# EAGLE design DC_400VCONVERTER2 (EAGLE 5.11)
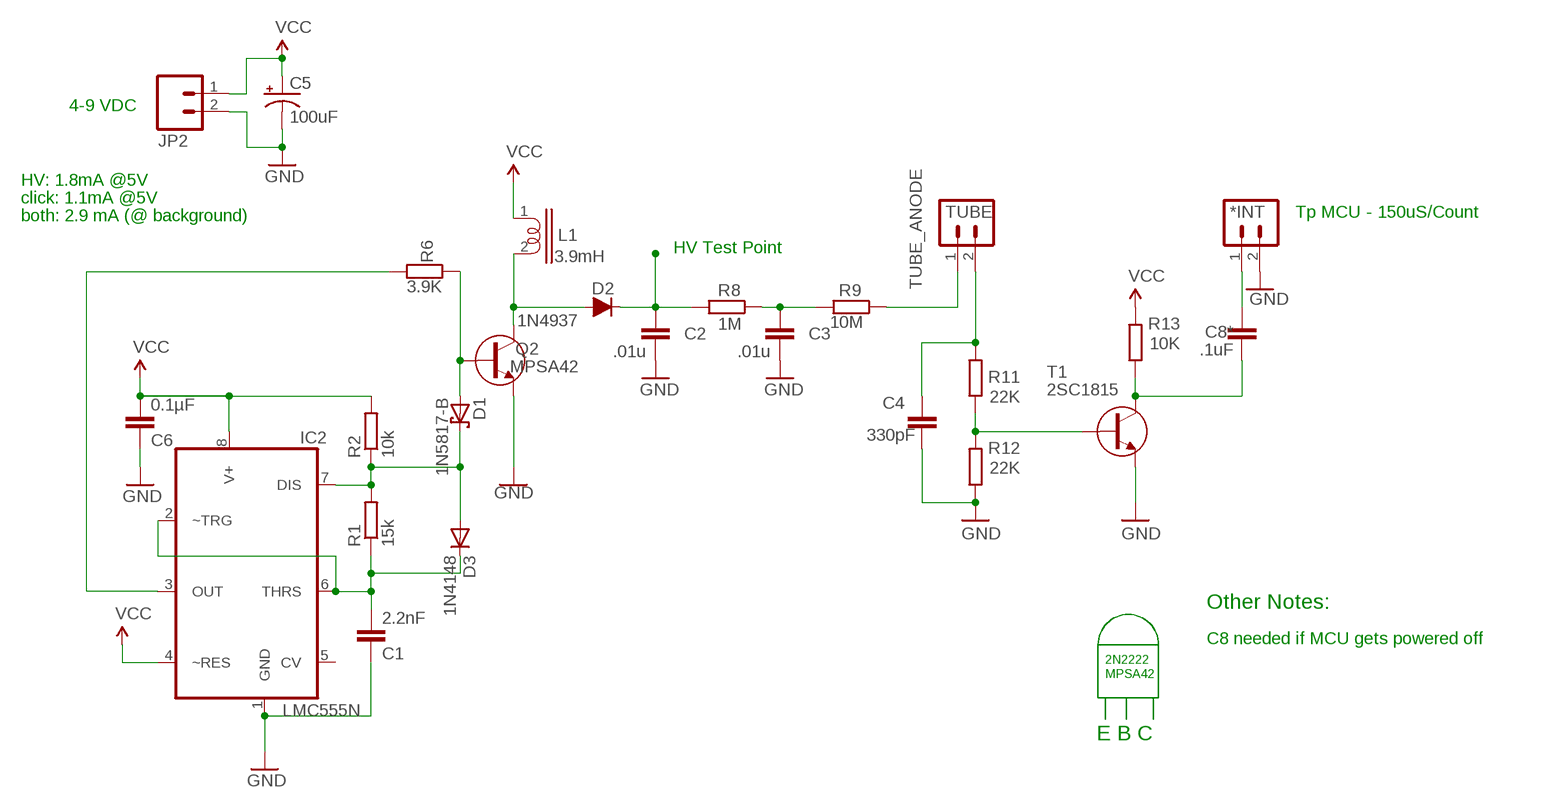
[diagram p0: schematic, sheet 1]

## Parts
*INT  M02PTH  [1X02]
C1  2.2nF  CAPPTH  [CAP-PTH-SMALL]
C2  .01u  C-EU050-025X075  [C050-025X075]
C3  .01u  C-EU050-025X075  [C050-025X075]
C4  330pF  CAPPTH  [CAP-PTH-SMALL]
C5  100uF  CAP_POLPTH1  [CPOL-RADIAL-100UF-25V]
C6  0.1µF  CAPPTH  [CAP-PTH-SMALL]
C8*  .1uF  CAPPTH  [CAP-PTH-SMALL]
D1  1N5817-B  [DO41-7.6]
D2  1N4937  [DO41-7]
D3  1N4148  [DO34-5]
IC2  LMC555N  [DIL08]
JP2  M02SCREW  [SCREWTERMINAL-3.5MM-2]
L1  3.9mH  POW_INDUCTOR_SHORT  [POW_INDUCTOR_TYPE08D]
Q2  MPSA42  [TO92-EBC]
R1  15k  R-EU_0204/5  [0204/5]
R2  10k  R-EU_0204/5  [0204/5]
R6  3.9K  R-EU_0204/5  [0204/5]
R8  1M  R-EU_0204/5  [0204/5]
R9  10M  R-EU_0204/5  [0204/5]
R11  22K  R-EU_0204/5  [0204/5]
R12  22K  R-EU_0204/5  [0204/5]
R13  10K  R-EU_0204/5  [0204/5]
T1  2SC1815  [TO92-ECB]
TUBE  M02PTH  [1X02]

## Nets
GND: *INT.2 C1.1 C2.2 C3.2 C4.1 C5.2(-) C6.1 IC2.1(GND) JP2.2 Q2.E R12.1 T1.1(E)
N$1: C1.2 D3.C IC2.2(~TRG) IC2.6(THRS) R1.1
N$2: C2.1 D2.C R8.2
N$5: C4.2 R11.2 TUBE.2
N$6: C3.1 R8.1 R9.2
N$8: R11.1 R12.2 T1.3(B)
N$9: IC2.3(OUT) R6.2
N$10: D1.A Q2.B R6.1
N$11: D1.C D3.A IC2.7(DIS) R1.2 R2.1
N$14: C8*.2 R13.1 T1.2(C)
N$16: *INT.1 C8*.1
N$17: D2.A L1.2 Q2.C
TUBE_ANODE: R9.1 TUBE.1
VCC: C5.1(+) C6.2 IC2.4(~RES) IC2.8(V+) JP2.1 L1.1 R2.2 R13.2
Unconnected: IC2.5(CV)

## Notes on the sheet
- 4-9 VDC
- HV: 1.8mA @5V
- click: 1.1mA @5V
- both: 2.9 mA (@ background) | Tp MCU - 150uS/Count
- HV Test Point
- Other Notes:
- C8 needed if MCU gets powered off
- 2N2222
- MPSA42
- E B C

## Library data of the parts
*INT JP2 TUBE = _JJG-parts:M02: Header 2 Standard 2-pin 0.1" header. Use with straight break away headers (SKU : PRT-00116), right angle break away headers (PRT-00553), swiss pins (PRT-00743), machine pins (PRT-00117), and female headers (PRT-00115). Molex polarized connector foot print use with SKU : PRT-08233 with associated crimp pins and housings.
C1 C4 C6 C8* = SparkFun:CAP: Capacitor Standard 0603 ceramic capacitor, and 0.1" leaded capacitor.
C2 C3 = resistor:C-EU: CAPACITOR, European symbol
C5 = SparkFun:CAP_POL: Capacitor Polarized These are standard SMD and PTH capacitors. Normally 10uF, 47uF, and 100uF in electrolytic and tantalum varieties. Always verify the external diameter of the through hole cap, it varies with capacity, voltage, and manufacturer. The EIA devices should be standard.
D1 = diode:1N581*: 1.0A SCHOTTKY BARRIER RECTIFIER Source: http://www.diodes.com/datasheets/ds23001.pdf
D2 = JPN:1N493*
D3 = My Library:1N4148
IC2 = My Library:LMC555: CMOS TIMER
L1 = JPN:POW_INDUCTOR_SHORT
Q2 = My Library:MPSA42
R1 R2 R6 R8 R9 R11-R13 = rcl:R-EU_: RESISTOR, European symbol
T1 = My Library:2SC*: NPN TRANSISTOR Big oval pads

## Board
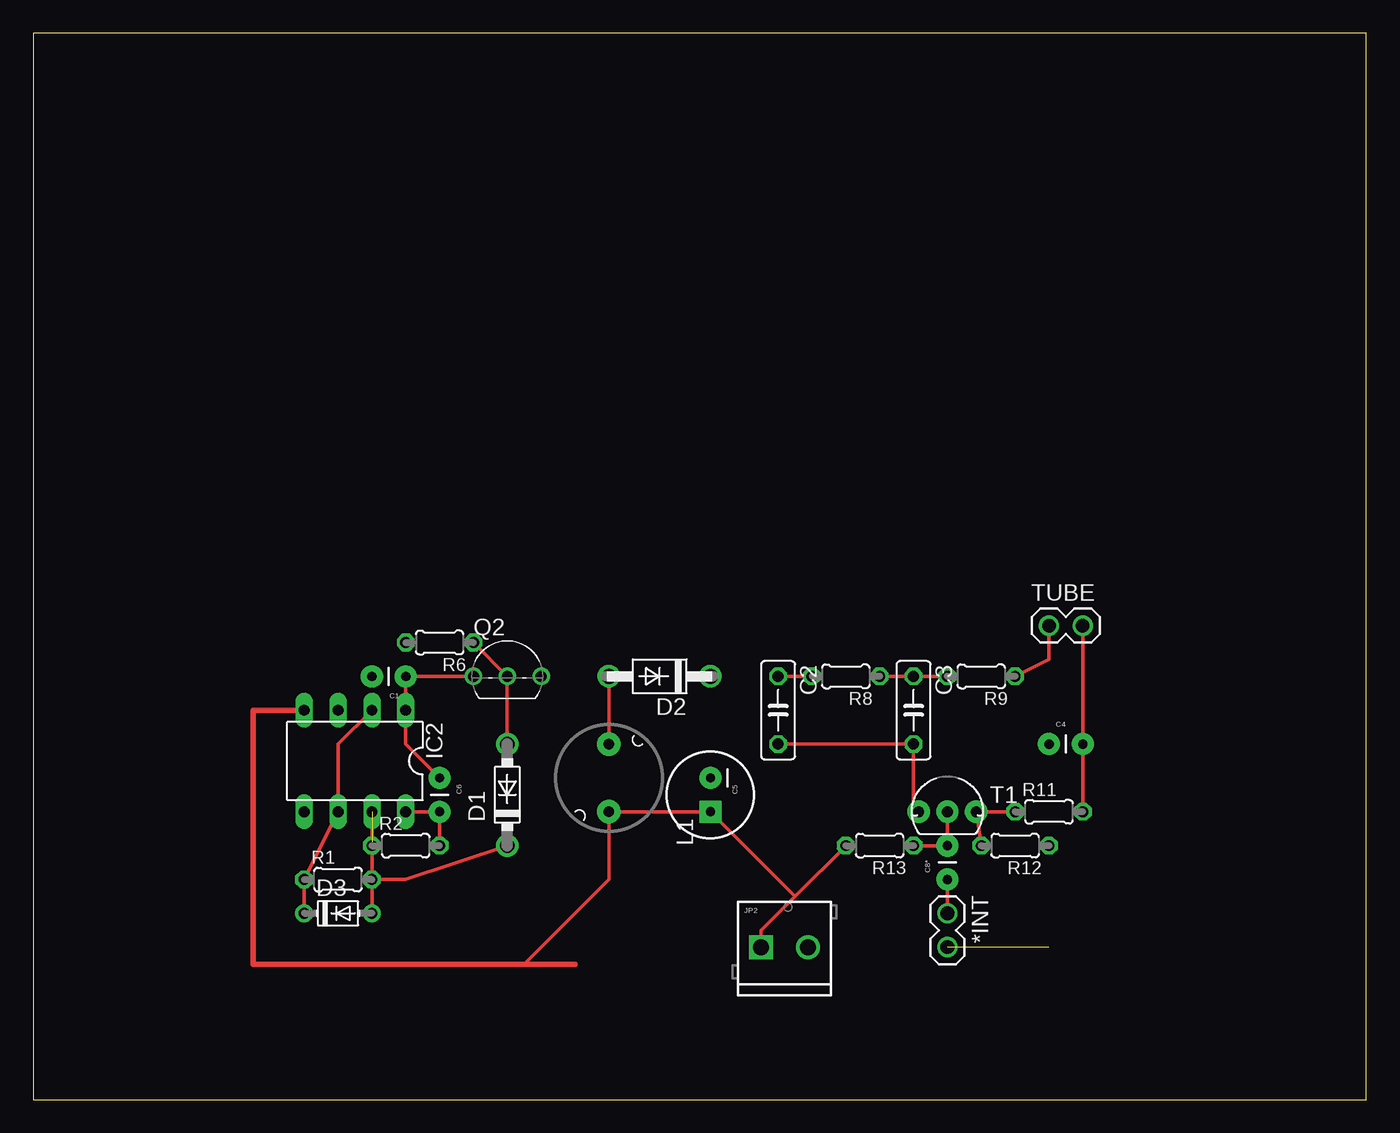
[diagram p1: board, top side]
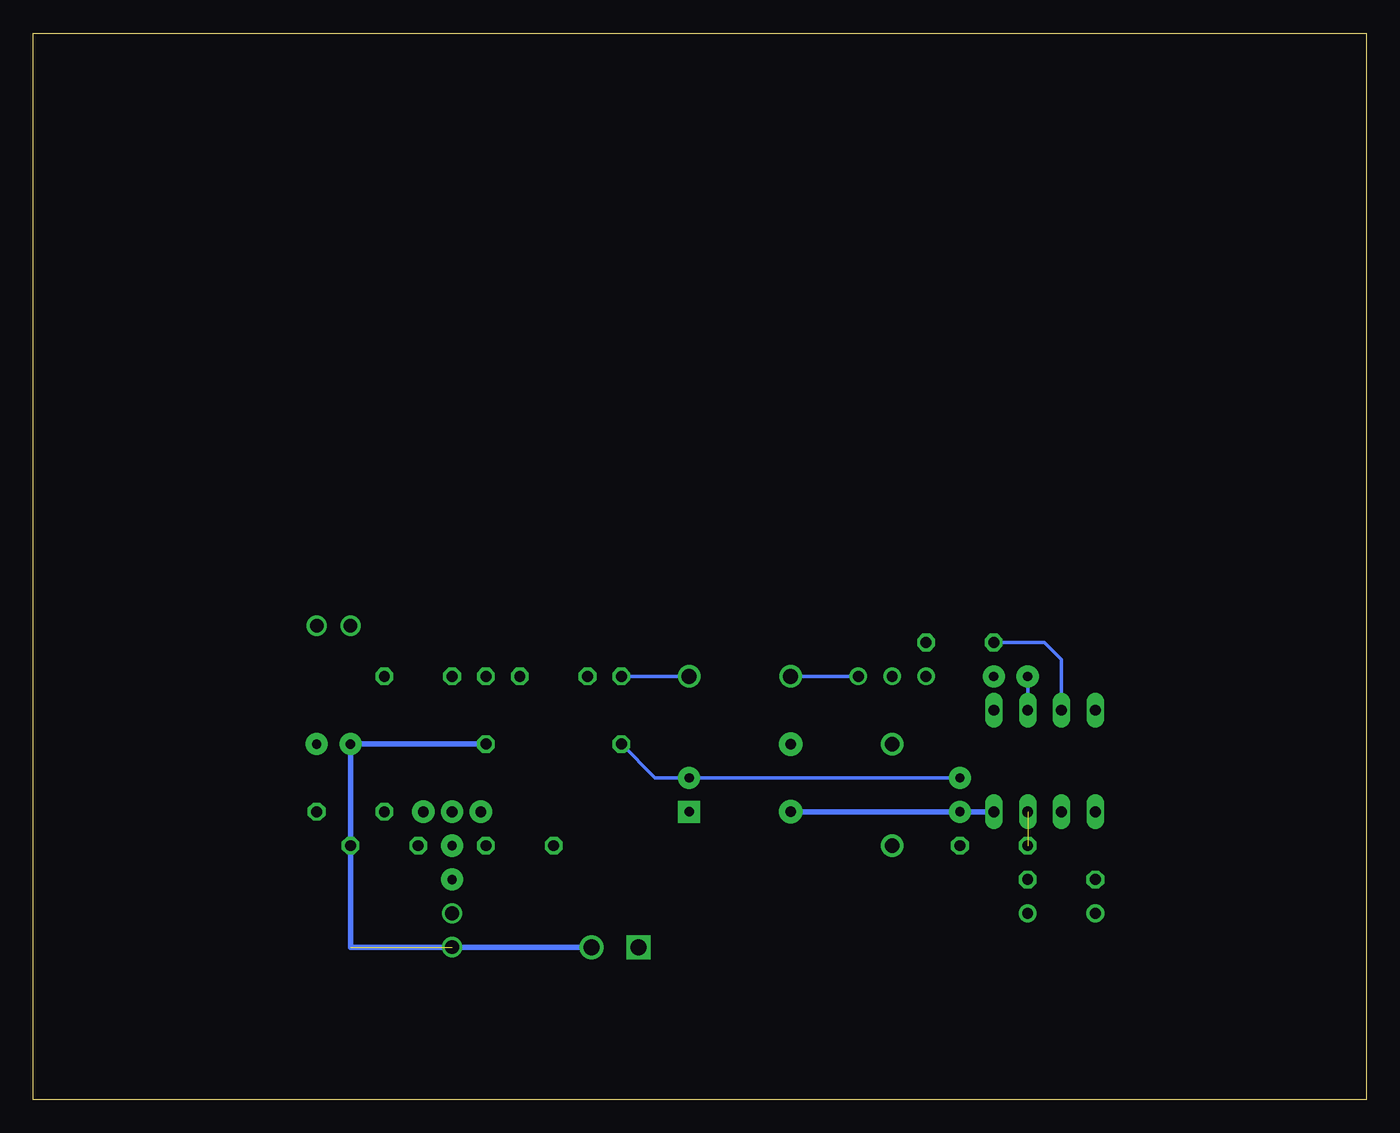
[diagram p2: board, bottom side, seen from below]

Size 100 x 80 mm. Coordinates in mm from the lower left corner, seen from the top.
Outline: 0,0 100,0 100,80 0,80 0,0
Copper layers (1*16): Top 0.035mm / dielectric 1.5mm / Bottom 0.035mm
Design rules "default": minimum track width 10mil, minimum drill 24mil, track to track 8mil, track to pad 8mil, pad to pad 8mil, via to via 8mil, smd to smd 8mil, copper to edge 40mil, drill to drill 8mil, minimum pad ring 10mil, minimum via ring 8mil, stop-mask expansion 4mil, vias tented up to drill 0mil, thermal gap 10mil

### Footprints (pad centres in the part's own frame; a part is rotated, then mirrored left to right if it is on the bottom)
1X02 = drill 1.016 round: 1 0,0; 2 2.54,0
CAP-PTH-SMALL = drill 0.7 pad 1.651 round: 1 0,0; 2 2.54,0
C050-025X075 = drill 0.813 octagon: 1 -2.54,0; 2 2.54,0
CPOL-RADIAL-100UF-25V = drill 0.7 pad 1.651 square: 1 1.27,0 | drill 0.7 pad 1.651 round: 2 -1.27,0
DO41-7.6 = drill 1.1 pad 1.7 round: A 3.81,0; C -3.81,0
DO41-7 = drill 1.118 round: A 2.54,0; C -5.08,0
DO34-5 = drill 0.813 round: A 2.54,0; C -2.54,0
DIL08 = drill 0.813 long: 1 -3.81,-3.81; 2 -1.27,-3.81; 3 1.27,-3.81; 4 3.81,-3.81; 5 3.81,3.81; 6 1.27,3.81; 7 -1.27,3.81; 8 -3.81,3.81
SCREWTERMINAL-3.5MM-2 = drill 1.2 square: 1 0,0 | drill 1.2 round: 2 3.5,0
POW_INDUCTOR_TYPE08D = drill 0.8 pad 1.778 round: 1 -2.54,0; 2 2.54,0
TO92-EBC = drill 0.813 round: B 0,-1.27; C 2.54,-1.27; E -2.54,-1.27
0204/5 = drill 0.813 octagon: 1 -2.54,0; 2 2.54,0
TO92-ECB = drill 0.813 pad 1.676 round: 1 -2.159,0; 2 0,0; 3 2.159,0

### Placement (x,y rotation side)
*INT  68.58,13.97 270 top
C1  27.94,31.75 180 top
C2  55.88,29.21 270 top
C3  66.04,29.21 270 top
C4  76.2,26.67 0 top
C5  50.8,22.86 270 top
C6  30.48,24.13 270 top
C8*  68.58,16.51 90 top
D1  35.56,22.86 90 top
D2  45.72,31.75 180 top
D3  22.86,13.97 0 top
IC2  24.13,25.4 180 top
JP2  54.61,11.43 0 top
L1  43.18,24.13 90 top
Q2  35.56,33.02 0 top
R1  22.86,16.51 0 top
R2  27.94,19.05 0 top
R6  30.48,34.29 180 top
R8  60.96,31.75 180 top
R9  71.12,31.75 180 top
R11  76.2,21.59 0 top
R12  73.66,19.05 180 top
R13  63.5,19.05 180 top
T1  68.58,21.59 0 top
TUBE  76.2,35.56 0 top

### Tracks (layer width: path | path; a pad name or v marks a point on that pad's centre or on a via)
GND  (1 unrouted)
  Top 0.254: C2.2 C3.2 66.04,21.59 T1.1 | Q2.E C1.1 IC2.1 27.94,26.67 C6.1
  Bottom 0.254: 58.42,11.43 JP2.2 | C6.1 33.02,24.13 C5.2 53.34,24.13 C2.2
  Bottom 0.406: C3.2 C4.1 R12.1 76.2,11.43 58.42,11.43
N$1
  Top 0.254: IC2.2 22.86,26.67 IC2.6 R1.1 D3.C
  Bottom 0.254: IC2.2 C1.2
N$2
  Top 0.254: C2.1 R8.2
  Bottom 0.254: D2.C C2.1
N$5
  Top 0.254: R11.2 C4.2 TUBE.2
N$6
  Top 0.254: R8.1 C3.1 R9.2
N$8
  Top 0.254: R12.2 T1.3 R11.1
N$9
  Bottom 0.254: IC2.3 22.86,33.02 24.13,34.29 R6.2
N$10
  Top 0.254: D1.A Q2.B R6.1
N$11  (1 unrouted)
  Top 0.254: R1.2 IC2.7 | D1.C 27.94,16.51 R1.2 | D3.A R1.2
N$14
  Top 0.254: R13.1 C8*.2 T1.2
N$16
  Top 0.254: *INT.1 C8*.1
N$17
  Top 0.254: L1.2 D2.A
  Bottom 0.254: D2.A Q2.C
TUBE_ANODE
  Top 0.254: R9.1 76.2,33.02 TUBE.1
VCC
  Top 0.254: R2.2 C6.2 IC2.8 | 57.15,15.24 54.61,12.7 JP2.1 | 57.15,15.24 R13.2 | 36.83,10.16 43.18,16.51 L1.1 C5.1 57.15,15.24
  Top 0.406: 40.64,10.16 36.83,10.16 16.51,10.16 16.51,29.21 IC2.4
  Bottom 0.406: L1.1 IC2.8